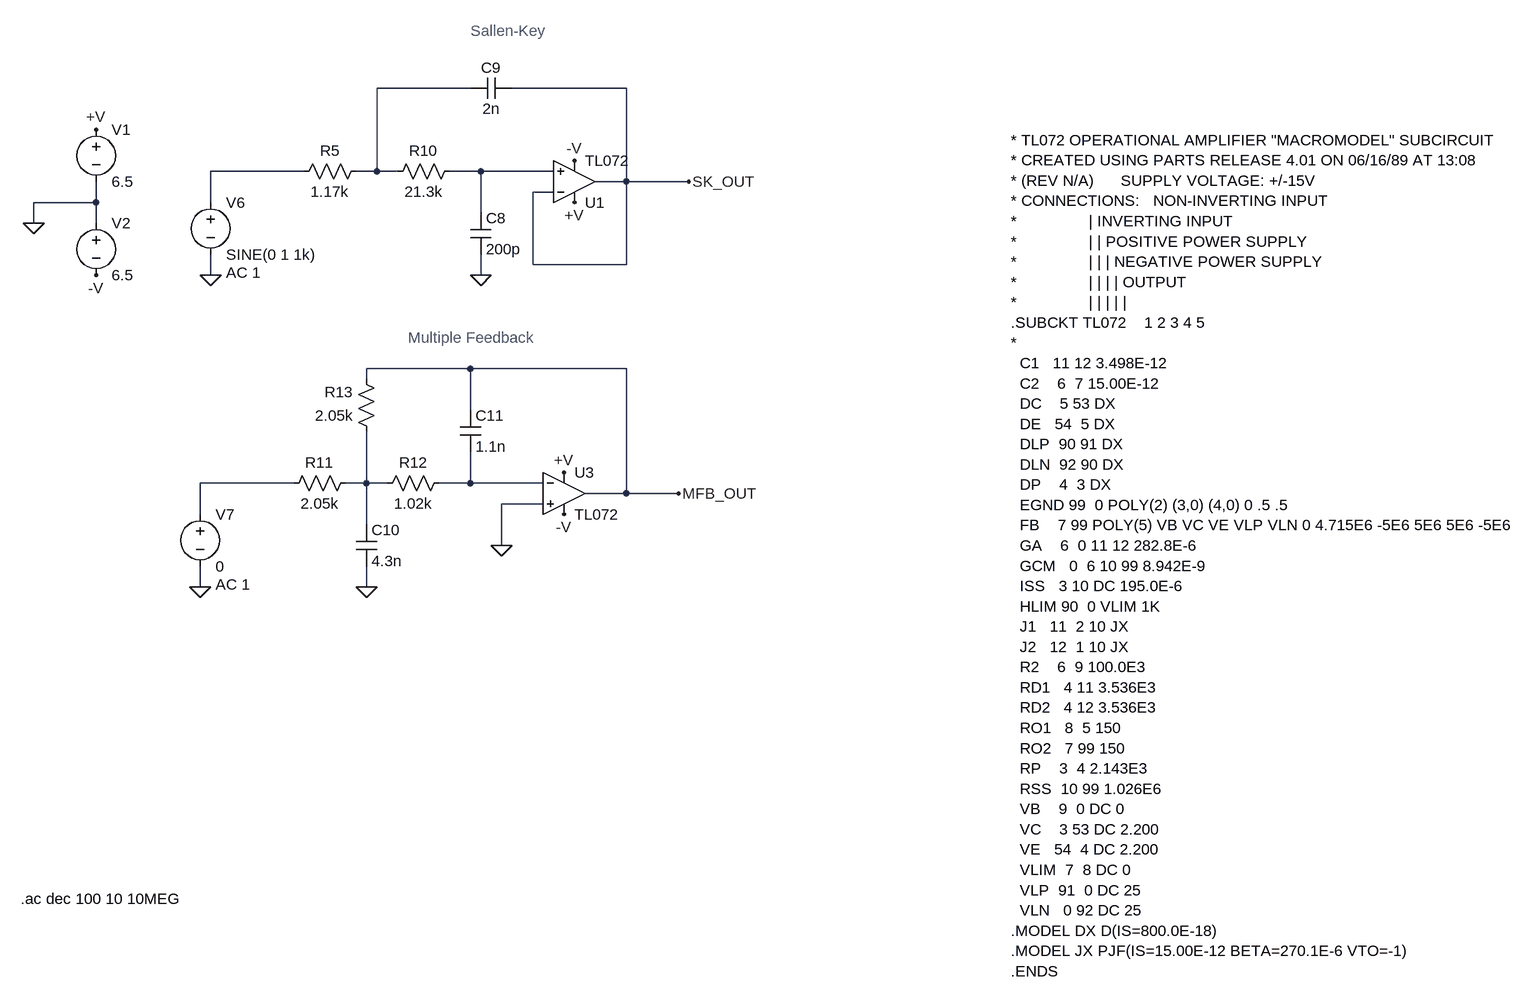
[diagram p0: schematic Active_filter_comparison.asc]
Active_filter_comparison.asc, the LTspice schematic file:
Version 4
SHEET 1 2040 820
WIRE 416 -1408 272 -1408
WIRE 656 -1408 480 -1408
WIRE 160 -1280 16 -1280
WIRE 272 -1280 272 -1408
WIRE 272 -1280 240 -1280
WIRE 304 -1280 272 -1280
WIRE 432 -1280 384 -1280
WIRE 544 -1280 432 -1280
WIRE 656 -1264 656 -1408
WIRE 656 -1264 608 -1264
WIRE 752 -1264 656 -1264
WIRE 544 -1248 512 -1248
WIRE -160 -1232 -160 -1264
WIRE -160 -1232 -256 -1232
WIRE 16 -1232 16 -1280
WIRE 432 -1216 432 -1280
WIRE -256 -1200 -256 -1232
WIRE -160 -1200 -160 -1232
WIRE 512 -1136 512 -1248
WIRE 656 -1136 656 -1264
WIRE 656 -1136 512 -1136
WIRE 16 -1120 16 -1152
WIRE 432 -1120 432 -1152
WIRE 432 -1120 416 -1120
WIRE 416 -976 256 -976
WIRE 656 -976 416 -976
WIRE 256 -960 256 -976
WIRE 416 -912 416 -976
WIRE 144 -800 0 -800
WIRE 256 -800 256 -880
WIRE 256 -800 224 -800
WIRE 288 -800 256 -800
WIRE 416 -800 416 -848
WIRE 416 -800 368 -800
WIRE 528 -800 416 -800
WIRE 656 -784 656 -976
WIRE 656 -784 592 -784
WIRE 736 -784 656 -784
WIRE 528 -768 464 -768
WIRE 0 -752 0 -800
WIRE 256 -736 256 -800
WIRE 464 -704 464 -768
WIRE 0 -640 0 -672
WIRE 256 -640 256 -672
WIRE 256 -640 240 -640
FLAG -256 -1200 0
FLAG -160 -1344 +V
FLAG -160 -1120 -V
FLAG 576 -1232 +V
FLAG 576 -1296 -V
FLAG 16 -1120 0
FLAG 432 -1120 0
FLAG 560 -816 +V
FLAG 560 -752 -V
FLAG 0 -640 0
FLAG 256 -640 0
FLAG 464 -704 0
FLAG 736 -784 MFB_OUT
FLAG 752 -1264 SK_OUT
SYMBOL voltage -160 -1360 R0
WINDOW 123 0 0 Left 0
WINDOW 39 0 0 Left 0
SYMATTR InstName V1
SYMATTR Value 6.5
SYMBOL voltage -160 -1216 R0
WINDOW 123 0 0 Left 0
WINDOW 39 0 0 Left 0
SYMATTR InstName V2
SYMATTR Value 6.5
SYMBOL voltage 16 -1248 R0
WINDOW 123 24 124 Left 2
WINDOW 39 0 0 Left 0
SYMATTR Value2 AC 1
SYMATTR InstName V6
SYMATTR Value SINE(0 1 1k)
SYMBOL res 256 -1296 R90
WINDOW 0 0 56 VBottom 2
WINDOW 3 32 56 VTop 2
SYMATTR InstName R5
SYMATTR Value 1.17k
SYMBOL res 400 -1296 R90
WINDOW 0 0 56 VBottom 2
WINDOW 3 32 56 VTop 2
SYMATTR InstName R10
SYMATTR Value 21.3k
SYMBOL cap 416 -1216 R0
SYMATTR InstName C8
SYMATTR Value 200p
SYMBOL cap 480 -1424 R90
WINDOW 0 0 32 VBottom 2
WINDOW 3 32 32 VTop 2
SYMATTR InstName C9
SYMATTR Value 2n
SYMBOL voltage 0 -768 R0
WINDOW 123 24 124 Left 2
WINDOW 39 0 0 Left 0
SYMATTR Value2 AC 1
SYMATTR InstName V7
SYMATTR Value 0
SYMBOL res 240 -816 R90
WINDOW 0 0 56 VBottom 2
WINDOW 3 32 56 VTop 2
SYMATTR InstName R11
SYMATTR Value 2.05k
SYMBOL res 384 -816 R90
WINDOW 0 0 56 VBottom 2
WINDOW 3 32 56 VTop 2
SYMATTR InstName R12
SYMATTR Value 1.02k
SYMBOL cap 240 -736 R0
SYMATTR InstName C10
SYMATTR Value 4.3n
SYMBOL res 272 -864 R180
WINDOW 0 36 76 Left 2
WINDOW 3 36 40 Left 2
SYMATTR InstName R13
SYMATTR Value 2.05k
SYMBOL cap 400 -912 R0
SYMATTR InstName C11
SYMATTR Value 1.1n
SYMBOL OpAmps\\opamp2 576 -1200 M180
SYMATTR InstName U1
SYMATTR Value TL072
SYMBOL OpAmps\\opamp2 560 -848 R0
SYMATTR InstName U3
SYMATTR Value TL072
TEXT 416 -1496 Left 2 ;Sallen-Key
TEXT 320 -1024 Left 2 ;Multiple Feedback
TEXT 1248 -1328 Left 2 !* TL072 OPERATIONAL AMPLIFIER "MACROMODEL" SUBCIRCUIT\n* CREATED USING PARTS RELEASE 4.01 ON 06/16/89 AT 13:08\n* (REV N/A)      SUPPLY VOLTAGE: +/-15V\n* CONNECTIONS:   NON-INVERTING INPUT\n*                | INVERTING INPUT\n*                | | POSITIVE POWER SUPPLY\n*                | | | NEGATIVE POWER SUPPLY\n*                | | | | OUTPUT\n*                | | | | |\n.SUBCKT TL072    1 2 3 4 5\n*\n  C1   11 12 3.498E-12\n  C2    6  7 15.00E-12\n  DC    5 53 DX\n  DE   54  5 DX\n  DLP  90 91 DX\n  DLN  92 90 DX\n  DP    4  3 DX\n  EGND 99  0 POLY(2) (3,0) (4,0) 0 .5 .5\n  FB    7 99 POLY(5) VB VC VE VLP VLN 0 4.715E6 -5E6 5E6 5E6 -5E6\n  GA    6  0 11 12 282.8E-6\n  GCM   0  6 10 99 8.942E-9\n  ISS   3 10 DC 195.0E-6\n  HLIM 90  0 VLIM 1K\n  J1   11  2 10 JX\n  J2   12  1 10 JX\n  R2    6  9 100.0E3\n  RD1   4 11 3.536E3\n  RD2   4 12 3.536E3\n  RO1   8  5 150\n  RO2   7 99 150\n  RP    3  4 2.143E3\n  RSS  10 99 1.026E6\n  VB    9  0 DC 0\n  VC    3 53 DC 2.200\n  VE   54  4 DC 2.200\n  VLIM  7  8 DC 0\n  VLP  91  0 DC 25\n  VLN   0 92 DC 25\n.MODEL DX D(IS=800.0E-18)\n.MODEL JX PJF(IS=15.00E-12 BETA=270.1E-6 VTO=-1)\n.ENDS
TEXT -276 -160 Left 2 !.ac dec 100 10 10MEG

The netlist it stands for:
* Active_filter_comparison.asc
V1 +V 0 6.5
V2 0 -V 6.5
V6 N002 0 SINE(0 1 1k) AC 1
R5 N001 N002 1.17k
R10 N003 N001 21.3k
C8 N003 0 200p
C9 SK_OUT N001 2n
V7 N004 0 0 AC 1
R11 N005 N004 2.05k
R12 N006 N005 1.02k
C10 N005 0 4.3n
R13 N005 MFB_OUT 2.05k
C11 MFB_OUT N006 1.1n
XU1 N003 SK_OUT +V -V SK_OUT TL072  ; pins In+ In- V+ V- OUT
XU3 0 N006 +V -V MFB_OUT TL072  ; pins In+ In- V+ V- OUT
* Sallen-Key
* Multiple Feedback
* TL072 OPERATIONAL AMPLIFIER "MACROMODEL" SUBCIRCUIT
* CREATED USING PARTS RELEASE 4.01 ON 06/16/89 AT 13:08
* (REV N/A)      SUPPLY VOLTAGE: +/-15V
* CONNECTIONS:   NON-INVERTING INPUT
*                | INVERTING INPUT
*                | | POSITIVE POWER SUPPLY
*                | | | NEGATIVE POWER SUPPLY
*                | | | | OUTPUT
*                | | | | |
.SUBCKT TL072    1 2 3 4 5
*
  C1   11 12 3.498E-12
  C2    6  7 15.00E-12
  DC    5 53 DX
  DE   54  5 DX
  DLP  90 91 DX
  DLN  92 90 DX
  DP    4  3 DX
  EGND 99  0 POLY(2) (3,0) (4,0) 0 .5 .5
  FB    7 99 POLY(5) VB VC VE VLP VLN 0 4.715E6 -5E6 5E6 5E6 -5E6
  GA    6  0 11 12 282.8E-6
  GCM   0  6 10 99 8.942E-9
  ISS   3 10 DC 195.0E-6
  HLIM 90  0 VLIM 1K
  J1   11  2 10 JX
  J2   12  1 10 JX
  R2    6  9 100.0E3
  RD1   4 11 3.536E3
  RD2   4 12 3.536E3
  RO1   8  5 150
  RO2   7 99 150
  RP    3  4 2.143E3
  RSS  10 99 1.026E6
  VB    9  0 DC 0
  VC    3 53 DC 2.200
  VE   54  4 DC 2.200
  VLIM  7  8 DC 0
  VLP  91  0 DC 25
  VLN   0 92 DC 25
.MODEL DX D(IS=800.0E-18)
.MODEL JX PJF(IS=15.00E-12 BETA=270.1E-6 VTO=-1)
.ENDS
.ac dec 100 10 10MEG
.backanno
.end